# Altium project Dual Feeder Controller.PrjPCB (part 2 of 2)

## Sheet Solenoid Drivers.SchDoc: Dual Feeder -
size Letter; DrawnBy: Mark Harris; Engineer: Mark Harris; Organization: Mark Harris; ProjectName: Dual Feeder Controller
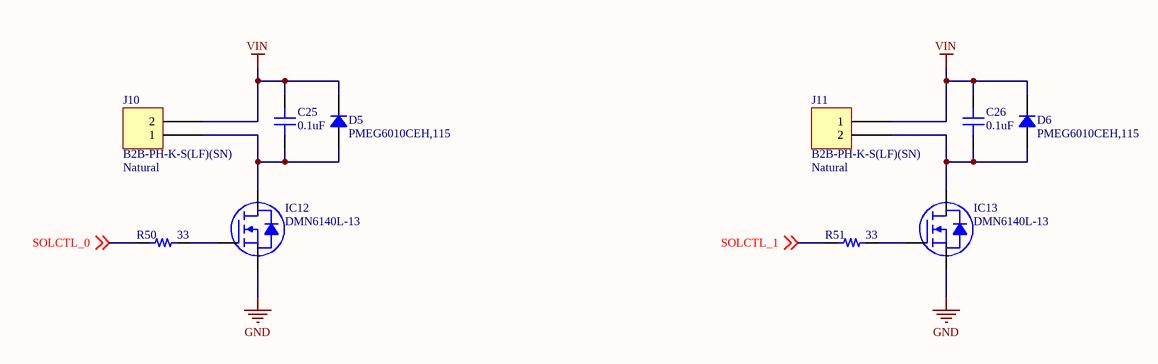
[diagram p4: Solenoid Drivers.SchDoc]

### Parts
C25  0.1uF  [CAP 0603/1608]
C26  0.1uF  [CAP 0603/1608]
D5  PMEG6010CEH,115  [SOD123F]
D6  PMEG6010CEH,115  [SOD123F]
IC12  DMN6140L-13  [DIODES SOT-23-3]
IC13  DMN6140L-13  [DIODES SOT-23-3]
J10  B2B-PH-K-S(LF)(SN)  Colour: Natural  [JST B2B-PH-K]
J11  B2B-PH-K-S(LF)(SN)  Colour: Natural  [JST B2B-PH-K]
R50  33  [RES 0603/1608]
R51  33  [RES 0603/1608]

### Nets
GND: IC12.3(S) IC13.3(S)
VIN: C25.1 C26.1 D5.2 D6.2 J10.2 J11.1
SOLCTL_0: R50.1 ; off-sheet SOLCTL_0
SOLCTL_1: R51.1 ; off-sheet SOLCTL_1
NetC25_2: C25.2 D5.1 IC12.2(D) J10.1
NetC26_2: C26.2 D6.1 IC13.2(D) J11.2
NetIC12_1: IC12.1(G) R50.2
NetIC13_1: IC13.1(G) R51.2

### Notes on the sheet
- Title
- Size:
- Date:
- Letter
- Number:
- Time:
- Revision:
- Sheet
- of
- File:

### Library data of the parts
C25 C26 = CL10B104JB8NNNC: CAP CER 0.1UF 50V X7R 0603; Manufacturer: Samsung Electro-Mechanics America, Inc.; TemperatureRange: -55C ~ 125C; Tolerance: 5%; Value: 0.1uF; Part Number: CL10B104JB8NNNC; PartId: 5416; Supplier 1: Digi-Key; Supplier Part Number 1: 1276-1033-2-ND; ComponentLink1Description: Datasheet; ComponentLink1URL: http://www.samsungsem.com/kr/support/product-search/mlcc/CL10B104JB8NNNC.jsp; ComponentLink2Description: Digi-Key listing; ComponentLink2URL: http://digikey.com/product-detail/en/CL10B104JB8NNNC/1276-1033-2-ND/3886691; TemperatureCoefficient: X7R; Voltage: 50V; Price: 0.0132; Type: -; Device Package: 0603 (1608 Metric)
D5 D6 = PMEG6010CEH,115: DIODE SCHOTTKY 60V 1A SOD123F; Manufacturer: NXP USA Inc.; Current Reverse Leakage @ Vr: 50uA @ 60V; Current Rectified: 1A (DC); Voltage Forward (Vf): 660mV @ 1A; Part Number: PMEG6010CEH,115; PartId: 29169; Supplier 1: Digi-Key; Supplier Part Number 1: 568-4104-1-ND; ComponentLink1Description: Datasheet; ComponentLink1URL: http://www.nxp.com/documents/data_sheet/PMEG6010CEH_PMEG6010CEJ.pdf; ComponentLink2Description: Digi-Key Listing; ComponentLink2URL: https://www.digikey.com/product-detail/en/nxp-usa-inc/PMEG6010CEH,115/568-4104-1-ND/1589917; Junction Operating Temperature: 150C (Max); Price: 0.38; Type: Schottky; Device Package: SOD-123F; Voltage DC Reverse (Vr): 60V
IC12 IC13 = DMN6140L-13: MOSFET N-CH 60V 1.6A SOT23; Manufacturer: Diodes Incorporated; Rds On (Max) at Id, Vgs: 140 mOhm @ 1.8A, 10V; Vgs(th) (Max) at Id: 20V; Gate Charge (Qg): 8.6nC @ 10V; Input Capacitance (Ciss) at Vds: 315pF @ 40V; Current Continuous Drain: 1.6A (Ta); Part Number: DMN6140L-13; PartId: 29565; Supplier 1: Digi-Key; Supplier Part Number 1: DMN6140L-13DICT-ND; ComponentLink1Description: Datasheet; ComponentLink1URL: http://diodes.com/_files/datasheets/DMN6140L.pdf; ComponentLink2Description: Digi-Key Listing; ComponentLink2URL: https://www.digikey.com/product-detail/en/diodes-incorporated/DMN6140L-13/DMN6140L-13DICT-ND/5218250; Price: 0.51; Type: N-Channel; Device Package: TO-236-3, SC-59, SOT-23-3; Drain to Source Voltage (Vdss): 60V
J10 J11 = B2B-PH-K-S(LF)(SN): CONN HEADER PH TOP 2POS 2MM; Manufacturer: JST Sales America Inc.; Pitch: 0.079" (2.00mm); Number Of Positions: 2; Part Number: B2B-PH-K-S(LF)(SN); PartId: 29447; Supplier 1: Digi-Key; Supplier Part Number 1: 455-1704-ND; ComponentLink1Description: Datasheet; ComponentLink1URL: http://www.jst-mfg.com/product/pdf/eng/ePH.pdf; ComponentLink2Description: Digi-Key Listing; ComponentLink2URL: http://www.digikey.com/product-detail/en/jst-sales-america-inc/B2B-PH-K-S(LF)(SN)/455-1704-ND/926611; Price: 0.17; Type: Header, Shrouded; Contact Finish: Tin; Fastening Type: Detent Lock; Number Of Rows: 1; Series: PH
R50 R51 = ERJ-3EKF33R0V: RES SMD 33 OHM 1% 1/10W 0603; Manufacturer: Panasonic Electronic Components; TemperatureRange: -55C ~ 155C; TemperatureCoefficient: 100ppm/C; PowerRating: 0.1W, 1/10W; Value: 33; Part Number: ERJ-3EKF33R0V; PartId: 901; Supplier 1: Digi-Key; Supplier Part Number 1: P33.0HTR-ND; ComponentLink1Description: Datasheet; ComponentLink1URL: http://industrial.panasonic.com/www-cgi/jvcr13pz.cgi?E+PZ+3+AOA0002+ERJ3EKF33R0V+7+WW; ComponentLink2Description: Digi-Key listing; ComponentLink2URL: http://digikey.com/product-detail/en/ERJ-3EKF33R0V/P33.0HTR-ND/1746383; Tolerance: 1%; Price: 0.0038; Type: Thick Film; Device Package: 0603 (1608 Metric)

## Sheet Light Gates.SchDoc: Dual Feeder -
size Letter; DrawnBy: Mark Harris; Engineer: Mark Harris; Organization: Mark Harris; ProjectName: Dual Feeder Controller
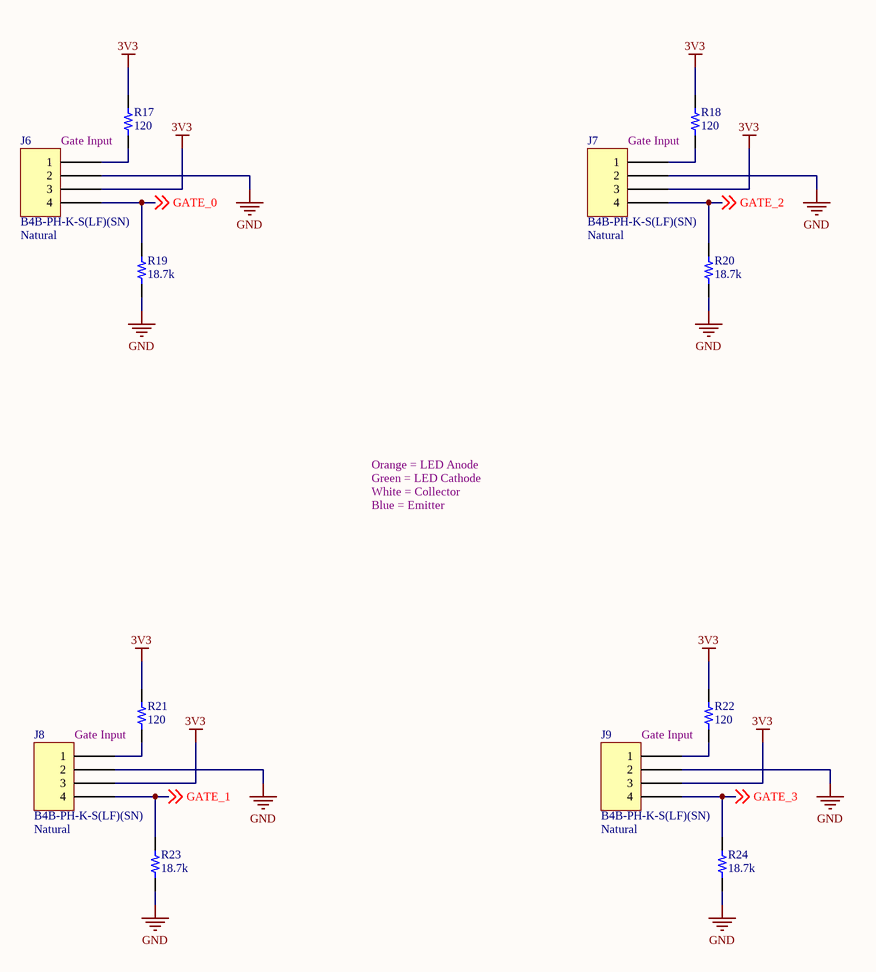
[diagram p5: Light Gates.SchDoc]

### Parts
J6  B4B-PH-K-S(LF)(SN)  Colour: Natural  [JST B4B-PH-K]
J7  B4B-PH-K-S(LF)(SN)  Colour: Natural  [JST B4B-PH-K]
J8  B4B-PH-K-S(LF)(SN)  Colour: Natural  [JST B4B-PH-K]
J9  B4B-PH-K-S(LF)(SN)  Colour: Natural  [JST B4B-PH-K]
R17  120  [RES 0603/1608]
R18  120  [RES 0603/1608]
R19  18.7k  [RES 0603/1608]
R20  18.7k  [RES 0603/1608]
R21  120  [RES 0603/1608]
R22  120  [RES 0603/1608]
R23  18.7k  [RES 0603/1608]
R24  18.7k  [RES 0603/1608]

### Nets
3V3: J6.3 J7.3 J8.3 J9.3 R17.2 R18.2 R21.2 R22.2
GND: J6.2 J7.2 J8.2 J9.2 R19.1 R20.1 R23.1 R24.1
GATE_0: J6.4 R19.2 ; off-sheet GATE_0
GATE_1: J8.4 R23.2 ; off-sheet GATE_1
GATE_2: J7.4 R20.2 ; off-sheet GATE_2
GATE_3: J9.4 R24.2 ; off-sheet GATE_3
NetJ6_1: J6.1 R17.1
NetJ7_1: J7.1 R18.1
NetJ8_1: J8.1 R21.1
NetJ9_1: J9.1 R22.1

### Notes on the sheet
- Gate Input
- Orange = LED Anode
- Green = LED Cathode
- Blue = Emitter
- White = Collector
- Title
- Size:
- Date:
- Letter
- Number:
- Time:
- Revision:
- Sheet
- of
- File:

### Library data of the parts
J6-J9 = B4B-PH-K-S(LF)(SN): CONN HEADER PH TOP 4POS 2MM; Manufacturer: JST Sales America Inc.; Pitch: 0.079" (2.00mm); Number Of Positions: 4; Part Number: B4B-PH-K-S(LF)(SN); PartId: 29449; Supplier 1: Digi-Key; Supplier Part Number 1: 455-1706-ND; ComponentLink1Description: Datasheet; ComponentLink1URL: http://www.jst-mfg.com/product/pdf/eng/ePH.pdf; ComponentLink2Description: Digi-Key Listing; ComponentLink2URL: http://www.digikey.com/product-detail/en/jst-sales-america-inc/B4B-PH-K-S(LF)(SN)/455-1706-ND/926613; Price: 0.24; Type: Header, Shrouded; Contact Finish: Tin; Fastening Type: Detent Lock; Number Of Rows: 1; Series: PH
R17 R18 R21 R22 = ERJ-3EKF1200V: RES SMD 120 OHM 1% 1/10W 0603; Manufacturer: Panasonic Electronic Components; TemperatureRange: -55C ~ 155C; TemperatureCoefficient: 100ppm/C; PowerRating: 0.1W, 1/10W; Value: 120; Part Number: ERJ-3EKF1200V; PartId: 1009; Supplier 1: Digi-Key; Supplier Part Number 1: P120HTR-ND; ComponentLink1Description: Datasheet; ComponentLink1URL: http://industrial.panasonic.com/www-cgi/jvcr13pz.cgi?E+PZ+3+AOA0002+ERJ3EKF1200V+7+WW; ComponentLink2Description: Digi-Key listing; ComponentLink2URL: http://digikey.com/product-detail/en/ERJ-3EKF1200V/P120HTR-ND/1746300; Tolerance: 1%; Price: 0.0038; Type: Thick Film; Device Package: 0603 (1608 Metric)
R19 R20 R23 R24 = ERJ-3EKF1872V: RES SMD 18.7K OHM 1% 1/10W 0603; Manufacturer: Panasonic Electronic Components; TemperatureRange: -55C ~ 155C; TemperatureCoefficient: 100ppm/C; PowerRating: 0.1W, 1/10W; Value: 18.7k; Part Number: ERJ-3EKF1872V; PartId: 1052; Supplier 1: Digi-Key; Supplier Part Number 1: P18.7KHTR-ND; ComponentLink1Description: Datasheet; ComponentLink1URL: http://industrial.panasonic.com/www-cgi/jvcr13pz.cgi?E+PZ+3+AOA0002+ERJ3EKF1872V+7+WW; ComponentLink2Description: Digi-Key listing; ComponentLink2URL: http://digikey.com/product-detail/en/ERJ-3EKF1872V/P18.7KHTR-ND/196169; Tolerance: 1%; Price: 0.0038; Type: Thick Film; Device Package: 0603 (1608 Metric)

## Nets that join several sheets
3V3: Controller (7 pins), Connectors (5 pins), Motor Drivers (R25.3 R27.3 R35.3 R37.3), Power Supply (5 pins), Light Gates (8 pins)
5V: Controller (D3.2 IC7.4), Power Supply (C31.2 IC14.1 IC14.3)
GND: Controller (18 pins), Connectors (17 pins), Motor Drivers (20 pins), Power Supply (12 pins), Solenoid Drivers (IC12.3 IC13.3), Light Gates (8 pins)
VIN: Connectors (IC2.3), Motor Drivers (10 pins), Power Supply (C20.2 C21.1 IC11.8 R45.1), Solenoid Drivers (6 pins)
BTN_GREEN_0: Controller (IC6.30), Connectors (C2.1 J3.2 R1.2)
BTN_GREEN_1: Controller (IC6.37), Connectors (C4.1 J4.2 R3.2)
BTN_LED_0: Controller (IC6.31), Connectors (IC3.1)
BTN_LED_1: Controller (IC6.38), Connectors (IC4.1)
BTN_YELLOW_0: Controller (IC6.28), Connectors (C3.1 J3.3 R2.2)
BTN_YELLOW_1: Controller (IC6.36), Connectors (C5.1 J4.3 R4.2)
GATE_0: Controller (IC6.32), Light Gates (J6.4 R19.2)
GATE_1: Controller (IC6.33), Light Gates (J8.4 R23.2)
GATE_2: Controller (IC6.34), Light Gates (J7.4 R20.2)
GATE_3: Controller (IC6.35), Light Gates (J9.4 R24.2)
H1_IN1: Controller (IC6.9), Motor Drivers (R29.1)
H1_IN2: Controller (IC6.10), Motor Drivers (R30.1)
H1_IN3: Controller (IC6.11), Motor Drivers (R32.1)
H1_IN4: Controller (IC6.12), Motor Drivers (R33.1)
H2_IN1: Controller (IC6.24), Motor Drivers (R39.1)
H2_IN2: Controller (IC6.25), Motor Drivers (R40.1)
H2_IN3: Controller (IC6.27), Motor Drivers (R42.1)
H2_IN4: Controller (IC6.26), Motor Drivers (R43.1)
LANECTL_0: Controller (IC6.40), Connectors (SW1.6)
LANECTL_1: Controller (IC6.43), Connectors (SW1.5)
PIO0_0-RESET: Controller (IC6.3 IC8.2 R16.1), Connectors (J12.10)
PIO0_10-SWCLK: Controller (IC6.29), Connectors (J12.4)
PIO0_15-SWDIO: Controller (IC6.39), Connectors (J12.2)
RS485_DIR: Controller (IC6.45), Connectors (IC1.2 IC1.3)
SOLCTL_0: Controller (IC6.2), Solenoid Drivers (R50.1)
SOLCTL_1: Controller (IC6.1), Solenoid Drivers (R51.1)
UART_RXD: Controller (IC6.47), Connectors (IC1.1)
UART_TXD: Controller (IC6.46), Connectors (IC1.4)